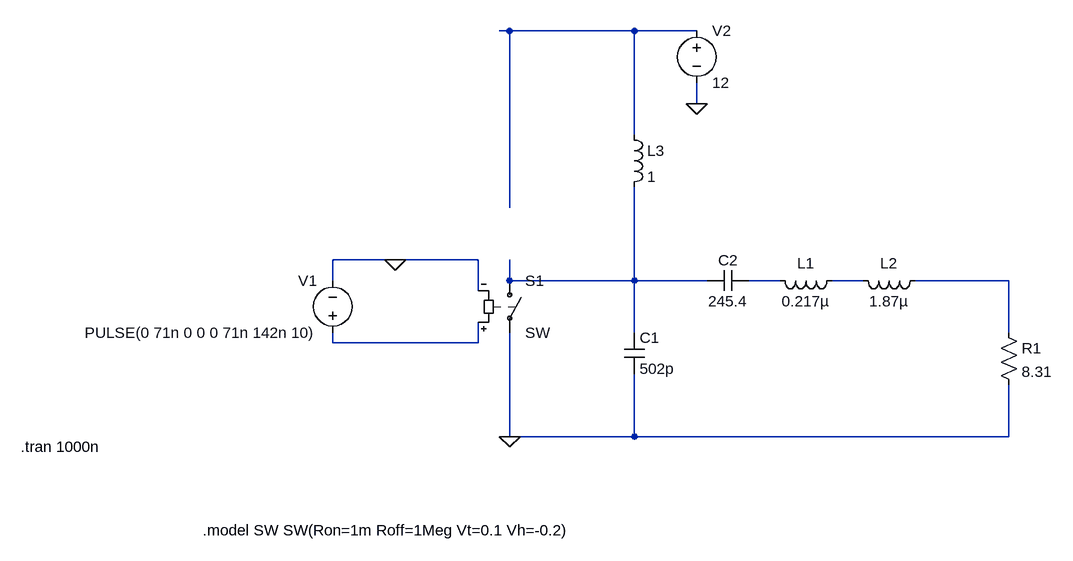
[diagram p0: schematic Draft14.asc]
Draft14.asc, the LTspice schematic file:
Version 4
SHEET 1 964 680
WIRE 112 -224 96 -224
WIRE 304 -224 112 -224
WIRE 400 -224 304 -224
WIRE 400 -112 400 -144
WIRE 304 -64 304 -224
WIRE 112 48 112 -224
WIRE -64 128 -160 128
WIRE 64 128 -64 128
WIRE -160 160 -160 128
WIRE 112 160 112 128
WIRE 304 160 304 16
WIRE 304 160 112 160
WIRE 416 160 304 160
WIRE 528 160 480 160
WIRE 656 160 608 160
WIRE 880 160 736 160
WIRE 64 176 64 128
WIRE 304 240 304 160
WIRE 880 240 880 160
WIRE -160 256 -160 240
WIRE 64 256 64 224
WIRE 64 256 -160 256
WIRE 112 400 112 240
WIRE 304 400 304 304
WIRE 304 400 112 400
WIRE 880 400 880 320
WIRE 880 400 304 400
FLAG -64 128 0
FLAG 400 -112 0
FLAG 112 400 0
SYMBOL sw 112 144 R0
SYMATTR InstName S1
SYMBOL voltage -160 256 R180
WINDOW 0 24 96 Left 2
WINDOW 3 24 16 Left 2
WINDOW 123 0 0 Left 0
WINDOW 39 0 0 Left 0
SYMATTR InstName V1
SYMATTR Value PULSE(0 71n 0 0 0 71n 142n 10)
SYMBOL cap 288 240 R0
SYMATTR InstName C1
SYMATTR Value 502p
SYMBOL cap 480 144 R90
WINDOW 0 0 32 VBottom 2
WINDOW 3 32 32 VTop 2
SYMATTR InstName C2
SYMATTR Value 245.4
SYMBOL res 864 224 R0
SYMATTR InstName R1
SYMATTR Value 8.31
SYMBOL ind 624 144 R90
WINDOW 0 5 56 VBottom 2
WINDOW 3 32 56 VTop 2
SYMATTR InstName L1
SYMATTR Value 0.217µ
SYMBOL ind 752 144 R90
WINDOW 0 5 56 VBottom 2
WINDOW 3 32 56 VTop 2
SYMATTR InstName L2
SYMATTR Value 1.87µ
SYMBOL ind 288 -80 R0
SYMATTR InstName L3
SYMATTR Value 1
SYMBOL voltage 400 -240 R0
SYMATTR InstName V2
SYMATTR Value 12
TEXT -640 416 Left 2 !.tran 1000n
TEXT -360 544 Left 2 !.model SW SW(Ron=1m Roff=1Meg Vt=0.1 Vh=-0.2)

The netlist it stands for:
* Draft14.asc
S1 N002 0 N006 0 SW
V1 N006 0 PULSE(0 71n 0 0 0 71n 142n 10)
C1 N002 0 502p
C2 N003 N002 245.4
R1 N005 0 8.31
L1 N004 N003 0.217µ
L2 N005 N004 1.87µ
L3 N001 N002 1
V2 N001 0 12
.tran 1000n
.model SW SW(Ron=1m Roff=1Meg Vt=0.1 Vh=-0.2)
.backanno
.end